# Altium schematic sheet POWER.SchDoc: Power Supply
size 420 x 297 mm; SheetNumber: 2; SheetTotal: 10
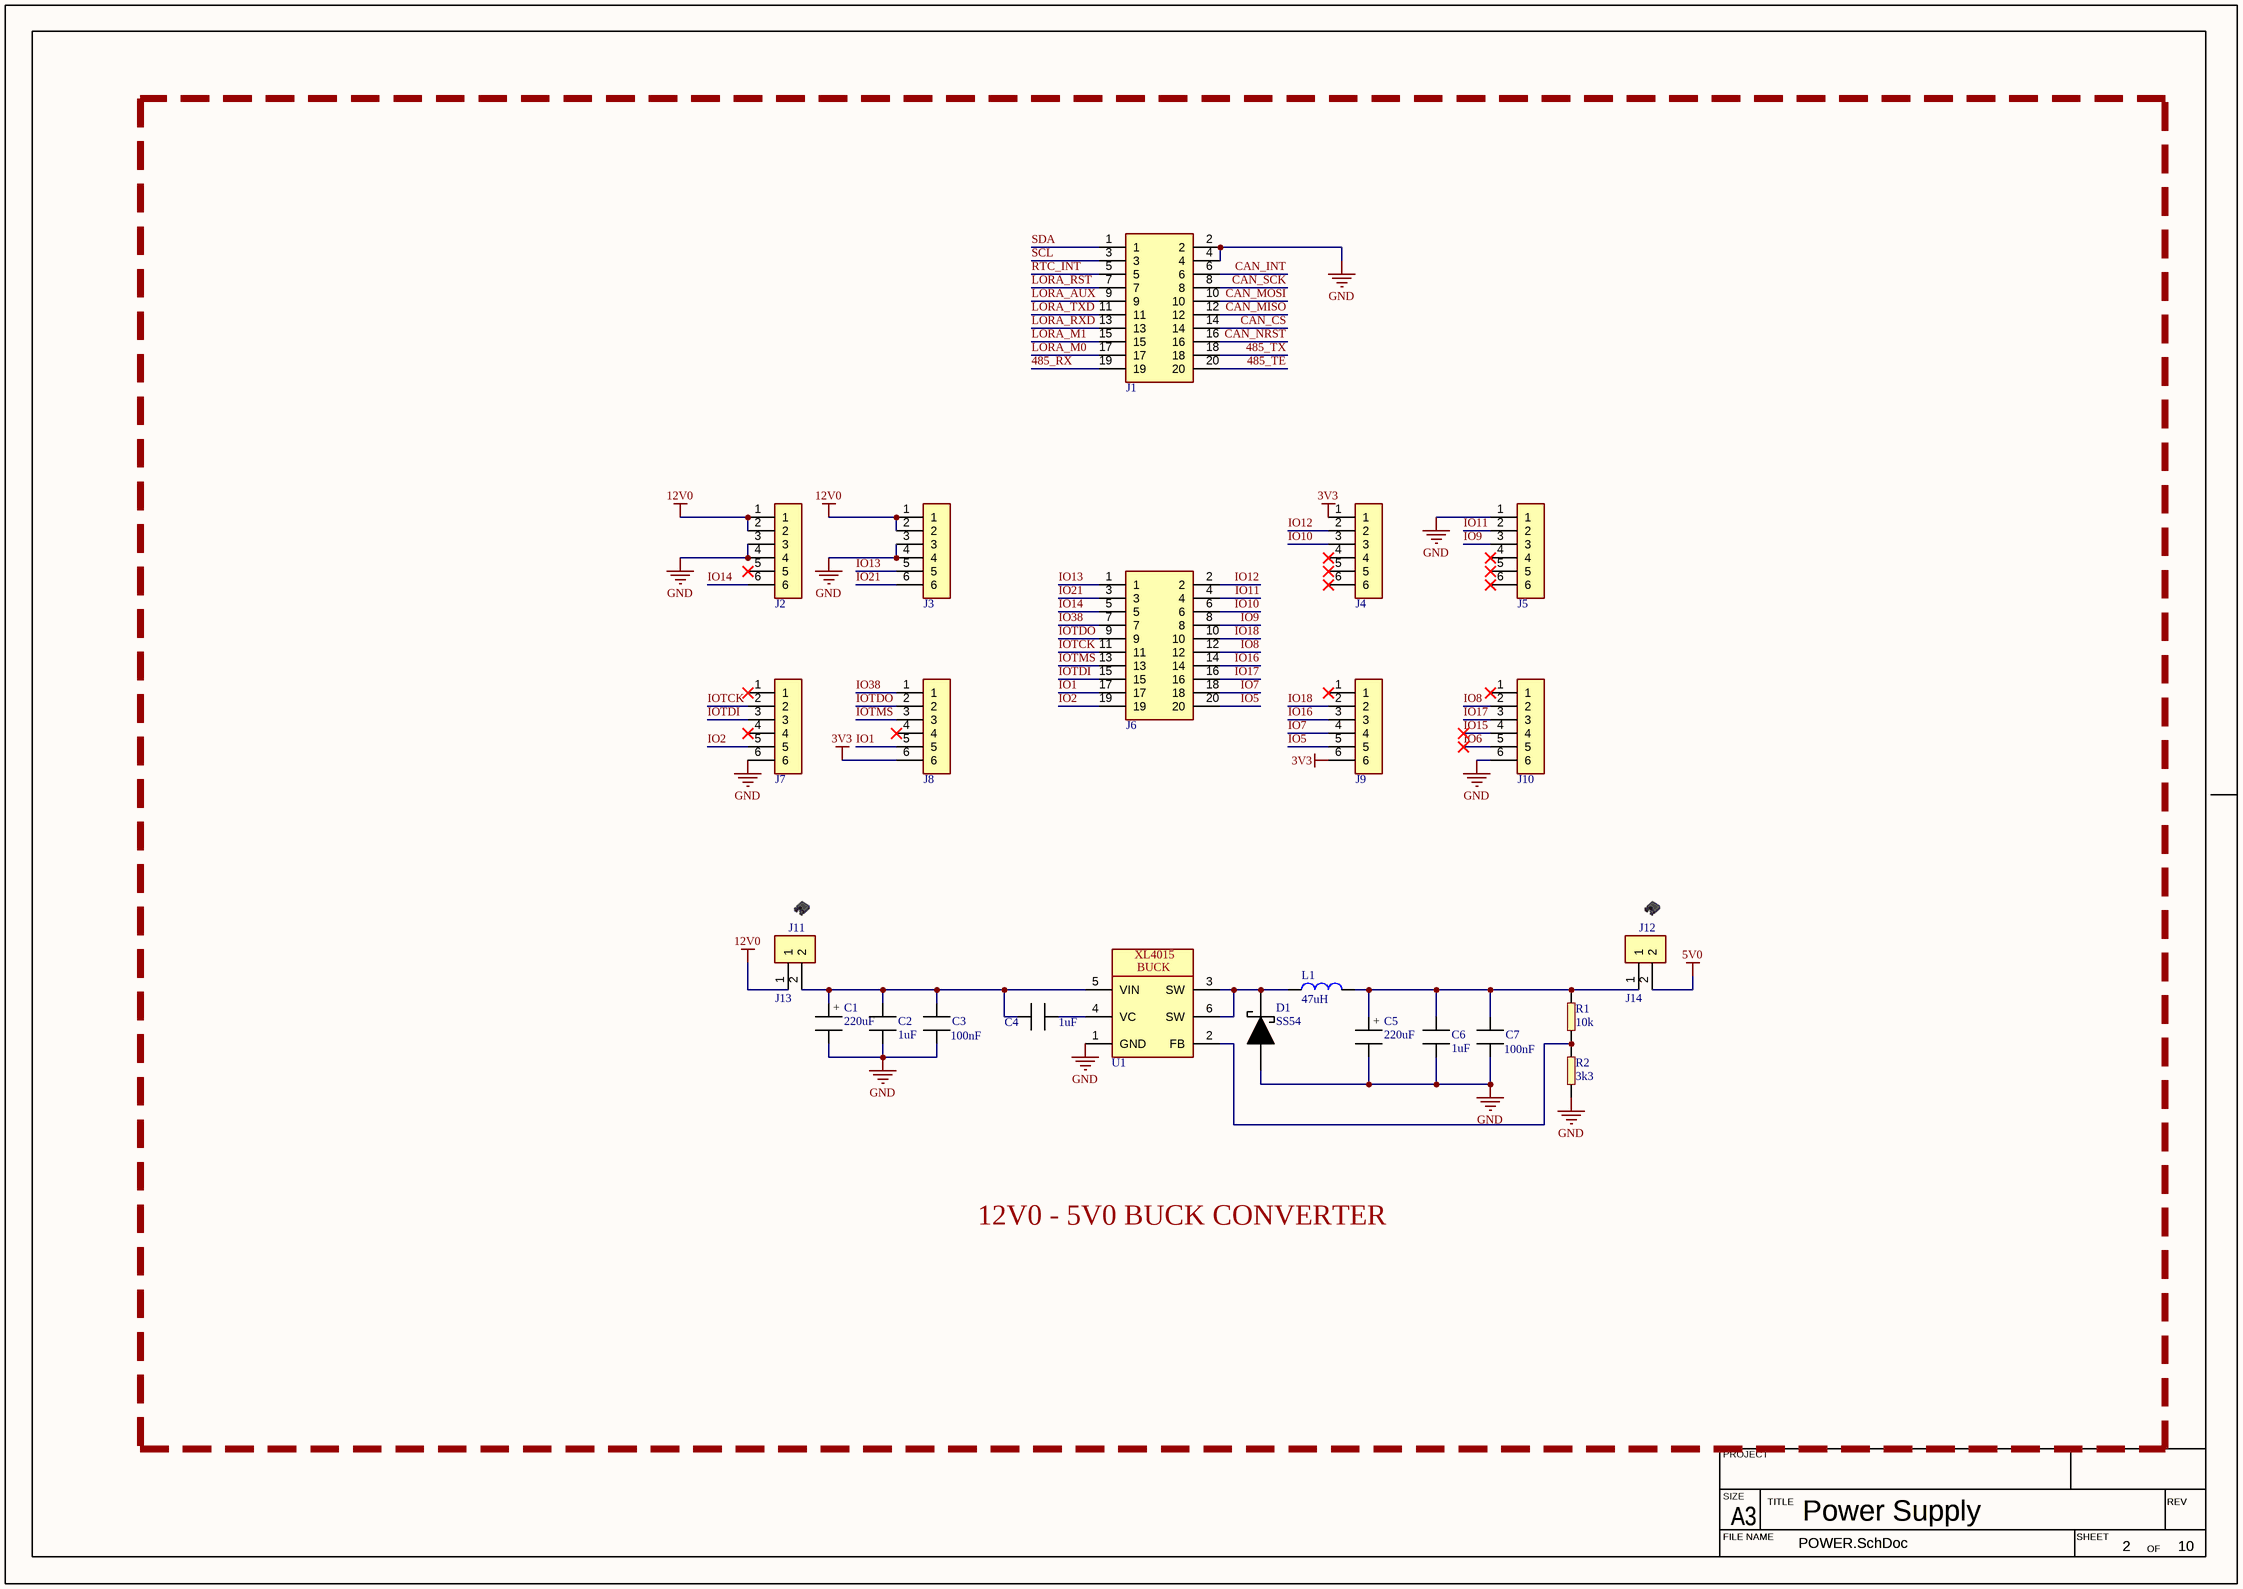
[diagram p0: POWER.SchDoc]

## Parts
C1  value 220uF  [CAP_D10_H16_P5 - Flat]  (hidden comment: ERP_102-2)
C2  value 1uF  [CAPC2012X13L]  (hidden comment: MLCC_0805)
C3  value 100nF  [CAPC2012X13L]  (hidden comment: MLCC_0805)
C4  value 1uF  [CAPC2012X13L]  (hidden comment: MLCC_0805)
C5  value 220uF  [CAP_D10_H16_P5 - Flat]  (hidden comment: ERP_102-2)
C6  value 1uF  [CAPC2012X13L]  (hidden comment: MLCC_0805)
C7  value 100nF  [CAPC2012X13L]  (hidden comment: MLCC_0805)
D1  value SS54  [DIOM6959X26L]  (hidden comment: ERP_104-3)
J1  20PX2R_M  [20PX2R_Male_THT_Shrouded]  (value not drawn)
J2  6PX1R_M  [6PX1R_M_STK20]  (value not drawn)
J3  6PX1R_M  [6PX1R_M_STK20]  (value not drawn)
J4  6PX1R_M  [6PX1R_M_STK20]  (value not drawn)
J5  6PX1R_M  [6PX1R_M_STK20]  (value not drawn)
J6  20PX2R_M  [20PX2R_Male_THT_Shrouded]  (value not drawn)
J7  6PX1R_M  [6PX1R_M_STK20]  (value not drawn)
J8  6PX1R_M  [6PX1R_M_STK20]  (value not drawn)
J9  6PX1R_M  [6PX1R_M_STK20]  (value not drawn)
J10  6PX1R_M  [6PX1R_M_STK20]  (value not drawn)
J11  Jumper Cap  (value not drawn)  (mechanical)
J12  Jumper Cap  (value not drawn)  (mechanical)
J13  2PX1R  [2PX1R]  (value not drawn)
J14  2PX1R  [2PX1R]  (value not drawn)
L1  value 47uH  [IND_1212]  (hidden comment: ERP_103-3)
R1  value 10k  [RES_0603]  (hidden comment: ERP_101-1)
R2  value 3k3  [RES_0603]  (hidden comment: ERP_101-1)
U1  XL4015  [XL4015]  (value not drawn)

## Blocks framed on the sheet
12V0 - 5V0 BUCK CONVERTER: C1-C7 D1 J1-J14 L1 R1 R2 U1

## Nets
3V3: J4.1 J8.6 J9.6
5V0: J14.2
12V0: J2.1 J2.2 J3.1 J3.2 J13.1
GND: C1.2 C2.2 C3.2 C5.2 C6.2 C7.2 D1.2(A) J1.2 J1.4 J2.3 J2.4 J3.3 J3.4 J5.1 J7.6 J10.6 R2.2 U1.1(GND)
485_RX: J1.19
485_TE: J1.20
485_TX: J1.18
CAN_CS: J1.14
CAN_INT: J1.6
CAN_MISO: J1.12
CAN_MOSI: J1.10
CAN_NRST: J1.16
CAN_SCK: J1.8
IO1: J6.17 J8.5
IO2: J6.19 J7.5
IO5: J6.20 J9.5
IO6: J10.5
IO7: J6.18 J9.4
IO8: J6.12 J10.2
IO9: J5.3 J6.8
IO10: J4.3 J6.6
IO11: J5.2 J6.4
IO12: J4.2 J6.2
IO13: J3.5 J6.1
IO14: J2.6 J6.5
IO15: J10.4
IO16: J6.14 J9.3
IO17: J6.16 J10.3
IO18: J6.10 J9.2
IO21: J3.6 J6.3
IO38: J6.7 J8.1
IOTCK: J6.11 J7.2
IOTDI: J6.15 J7.3
IOTDO: J6.9 J8.2
IOTMS: J6.13 J8.3
LORA_AUX: J1.9
LORA_M0: J1.17
LORA_M1: J1.15
LORA_RST: J1.7
LORA_RXD: J1.13
LORA_TXD: J1.11
RTC_INT: J1.5
SCL: J1.3
SDA: J1.1
NetC1_1: C1.1 C2.1 C3.1 C4.1 J13.2 U1.5(VIN)
NetC4_2: C4.2 U1.4(VC)
NetC5_1: C5.1 C6.1 C7.1 J14.1 L1.2 R1.1
NetD1_1: D1.1(C) L1.1 U1.3(SW) U1.6(SW)
NetR1_2: R1.2 R2.1 U1.2(FB)

Not connected (* = marked no-connect by the designer): J2 5*; J4 4* 5* 6*; J5 4* 5* 6*; J7 1* 4*; J8 4*; J9 1*; J10 1*

## Notes on the sheet
- PROJECT
- SIZE
- FILE NAME
- A3
- TITLE
- SHEET
- OF
- REV
- (in symbol CAP_D10_H16_P5) +
- (in symbol XL4015) BUCK

## Library data of the parts
C1 C5 = CAP_D10_H16_P5: Electrolytic Capacitor Through Hole D10 P5.0; Package: 10X5; Manufacturer 1: *; Manufacturer Part Number 1: *; Supplier 1: *
C2-C4 C6 C7 = MLCC_0805: Chip Capacitor, 2-Leads, Body 2.00x1.25mm, IPC High Density; Package: 0805; Manufacturer 1: *; Manufacturer Part Number 1: *
D1 = SS54: Supplier Part Number 1: *; Supplier  1: *; Package: SMC; Manufacturer Part Number 1: *; Manufacturer 1: *; ERP: *
J1 J6 = 20PX2R_M: Connector Header Surface Mount 20 position 0.100" (2.54mm); Manufacturer 1: CNC Tech; Value: *; Manufacturer Part Number 1: *
J2-J5 J7-J10 = 6PX1R_M: 6PX1R Male Header; Value: *; Manufacturer 1: *; Manufacturer Part Number 1: *
J11 J12 = Jumper Cap: 2 Pin Jumper Cap P2.54; Manufacturer Part Number 1: *; Manufacturer 1: *; Value: *
L1 = IND_1212: Manufacturer 1: Würth Elektronik; Manufacturer Part Number 1: *
R1 = RES_0603: Package: 0603; Manufacturer 1: *; Manufacturer Part Number 1: *
R2 = RES_0603: Manufacturer Part Number 1: 560112116003; Package: 0603; Manufacturer 1: *
U1 = XL4015: 5A 180KHz 36V Buck DC to DC Converter; Manufacturer 1: XLSemi; Manufacturer Part Number 1: XL4015E1; Value: *